# EasyEDA schematic ESP8266_WS.json
TITLE: ESP8266_WS; REV: 1.0; Date: 04/06/2025; Sheet: 1/1
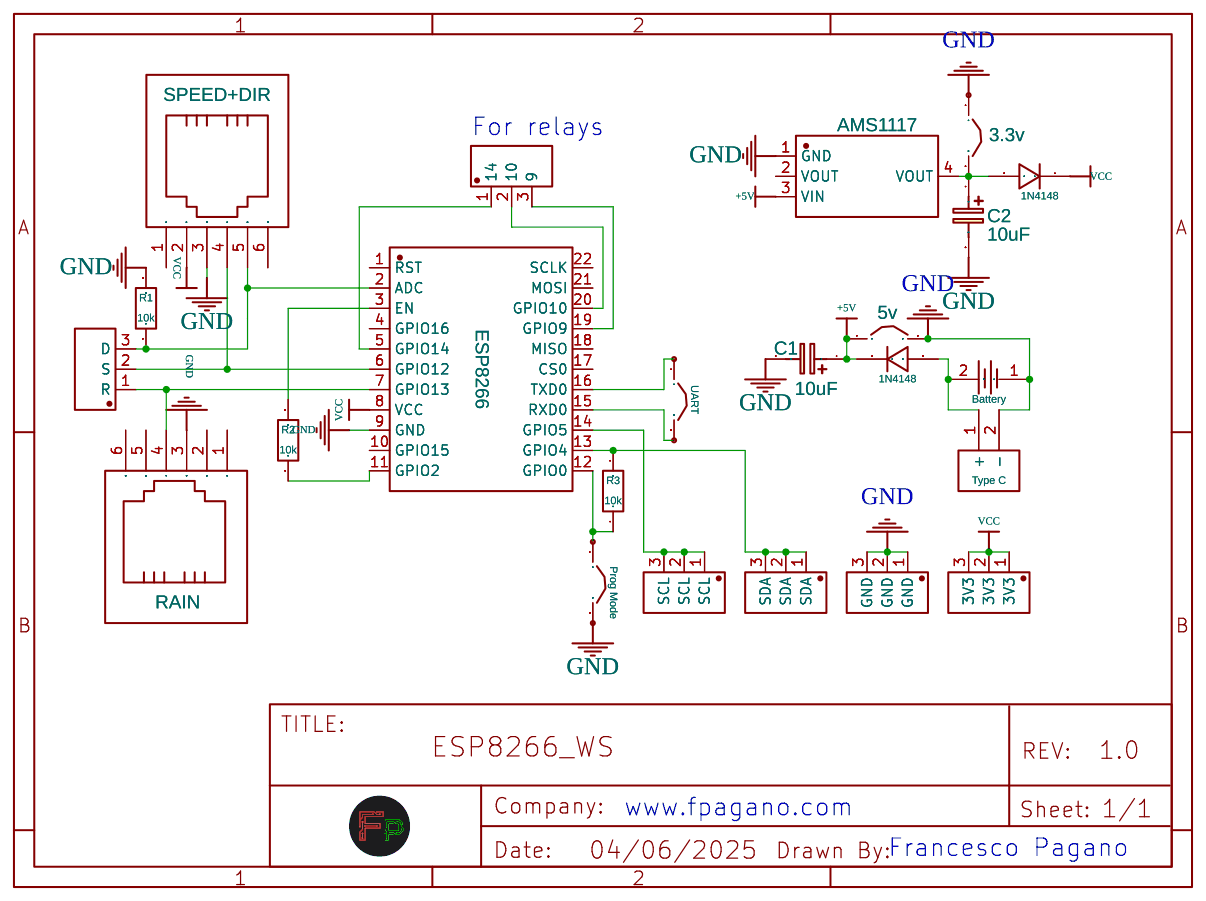
[diagram p0: schematic sheet]

## Parts
3V3  3V3  [HEADER - HEADER-FEMALE-2.54_1X3]
AMS1117  AMS1117  [SOT-223-3_L6.5-W3.4-P2.30-LS7.0-BR]
BATTERY  Battery  [BATTERY-SMD_18650-1S-L77.1-W20.7-1]
C1  10uF  [CAP-D4.0×F1.5]
C2  10uF  [CAP-D4.0×F1.5]
D1  1N4148  [DO-35_BD2.0-L4.2-P8.20-D0.5-RD]
D2  1N4148  [DO-35_BD2.0-L4.2-P8.20-D0.5-RD]
ESP8266  ESP8266  [WIFIM-SMD_ESP-12F-ESP8266MOD]
GND  GND  [HEADER - HEADER-FEMALE-2.54_1X3]
GPIO  GPIO  [HEADER - HEADER-FEMALE-2.54_1X3]
J-3V3  3.3v  [HDR-TH_2P-P2.54-V-M-1]
J-5V  5v  [HDR-TH_2P-P2.54-V-M-1]
OUT  OUT  [HEADER - HEADER-FEMALE-2.54_1X3]
PROG-MODE  Prog Mode  [HDR-TH_2P-P2.54-V-M-1]
R1  10k  [R_AXIAL-0.3]
R2  10k  [R_AXIAL-0.3]
R3  10k  [R_AXIAL-0.3]
RAIN  RAIN  [ARUN-RJ11-6P6C]
SCL  SCL  [HEADER - HEADER-FEMALE-2.54_1X3]
SDA  SDA  [HEADER - HEADER-FEMALE-2.54_1X3]
SPEED-DIRECTION  SPEED+DIR  [ARUN-RJ11-6P6C]
TYPEC  Type C  [USB TYPE C 2 PIN]
UART  UART  [HDR-TH_2P-P2.54-V-M-1]

## Library data of the parts
3V3 GND GPIO OUT SCL SDA = HEADER FEMALE 2.54 1X3: Contributor: sohail.hdesign
AMS1117 = AMS1117-3.3: sourceId: dwIGgezVh; Supplier: LCSC; Manufacturer: AMS; Supplier Part: C6186; JLCPCB Part Class: Basic Part
BATTERY = BH-18650-B6AA002: Supplier: LCSC; Supplier Part: C7525438; Manufacturer: MYOUNG(美阳); Contributor: lcsc; JLCPCB Part Class: Extended Part
C1 C2 = CE_TH_D4.0×F1.5_EU: Contributor: LCEDA_Lib
D1 D2 = 1N4148: Supplier: LCSC; Supplier Part: C13769; Manufacturer: STMicroelectronics; Contributor: LCSC
ESP8266 = ESP8266: LINK: https://img.jlc.com/image//data/smt-stock-produce/componentSizePhoto/2021-12-02/b5eb61357b2a478295008aee8c894ebd/BG2111290693_D21112900056_font.png; Contributor: LCSC; Supplier: LCSC; Supplier Part: C9900003049; Manufacturer: null; JLCPCB Part Class: Extended Part
J-3V3 J-5V PROG-MODE UART = JUMPERTHRUHOLE: Supplier Part: NONE; Manufacturer: NONE; Manufacturer Part: NONE; Contributor: RaspAutomacao
R1-R3 = R_AXIAL-0.3_EU: Contributor: LCEDA_Lib
RAIN SPEED-DIRECTION = ARUN--RJ11-6P6C: Manufacturer: RS PRO; Manufacturer Part: 331-6421; Supplier: RS-Online; Supplier Part: 331-6421; link: https://nz.rs-online.com/web/p/rj11-connectors/3316409/; Contributor: daveh25
TYPEC = usb type C 2 pin: Contributor: zikratiy

## Nets
+5V: AMS1117.3(VIN) C1.1 D1.1 J-5V.1
GND: AMS1117.1(GND) BATTERY.1 C1.2 C2.2 ESP8266.9(GND) GND.1(GND) GND.2(GND) GND.3(GND) J-3V3.1 J-5V.2 PROG-MODE.2 R1.2 RAIN.3 SPEED-DIRECTION.3 TYPEC.2(-)
VCC: 3V3.1(3V3) 3V3.2(3V3) 3V3.3(3V3) D2.1 ESP8266.8(VCC) SPEED-DIRECTION.2
Net-(AMS1117-4): AMS1117.4(VOUT) C2.1 D2.2 J-3V3.2
Net-(BATTERY-2): BATTERY.2 D1.2 TYPEC.1(+)
Net-(ESP8266-2): ESP8266.2(ADC) OUT.3(D) R1.1 SPEED-DIRECTION.5
Net-(ESP8266-3): ESP8266.3(EN) R2.2
Net-(ESP8266-5): ESP8266.5(GPIO14) GPIO.1(14)
Net-(ESP8266-6): ESP8266.6(GPIO12) OUT.2(S) SPEED-DIRECTION.4
Net-(ESP8266-7): ESP8266.7(GPIO13) OUT.1(R) RAIN.4
Net-(ESP8266-11): ESP8266.11(GPIO2) R2.1
Net-(ESP8266-12): ESP8266.12(GPIO0) PROG-MODE.1 R3.1
Net-(ESP8266-13): ESP8266.13(GPIO4) R3.2 SDA.1(SDA) SDA.2(SDA) SDA.3(SDA)
Net-(ESP8266-14): ESP8266.14(GPIO5) SCL.1(SCL) SCL.2(SCL) SCL.3(SCL)
Net-(ESP8266-15): ESP8266.15(RXD0) UART.2
Net-(ESP8266-16): ESP8266.16(TXD0) UART.1
Net-(ESP8266-19): ESP8266.19(GPIO9) GPIO.3(9)
Net-(ESP8266-20): ESP8266.20(GPIO10) GPIO.2(10)

Not connected (* = marked no-connect by the designer): AMS1117 2(VOUT); ESP8266 1(RST) 4(GPIO16) 10(GPIO15) 17(CS0) 18(MISO) 21(MOSI) 22(SCLK); RAIN 1 2 5 6; SPEED-DIRECTION 1 6

## Notes on the sheet
- For relays
- www.fpagano.com
- Francesco Pagano
